# Altium schematic sheet Connectors.SchDoc
size A4; SheetNumber: 3; SheetTotal: 3
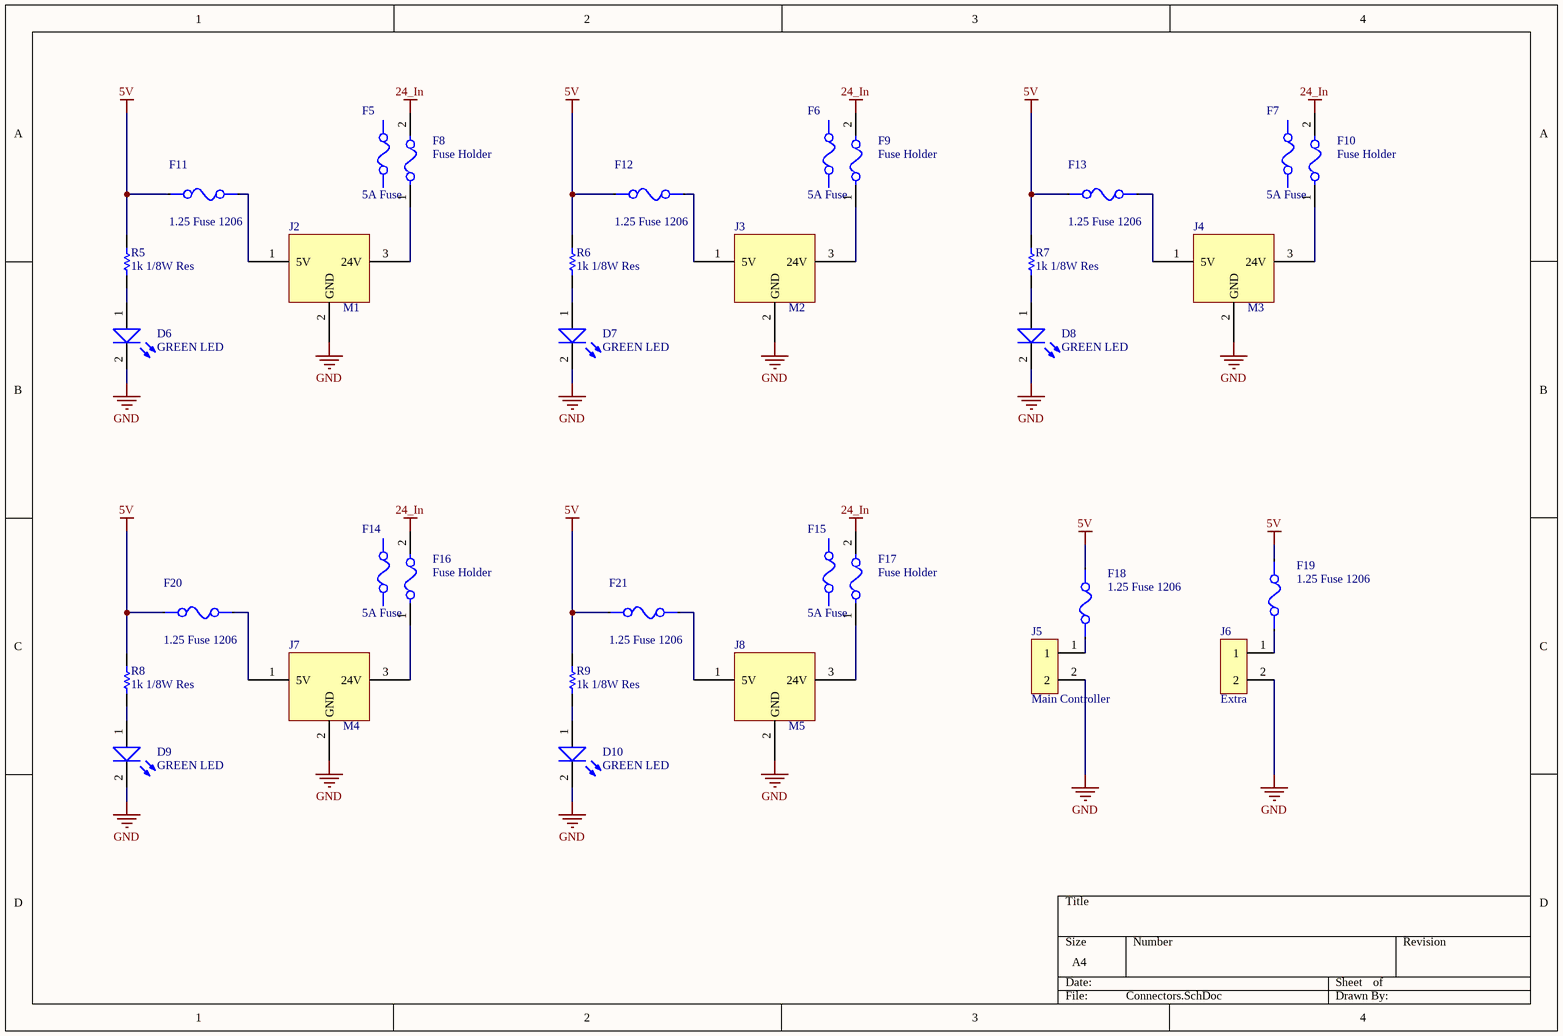
[diagram p0: Connectors.SchDoc]

## Parts
D6  GREEN LED  [LED Through Hole]
D7  GREEN LED  [LED Through Hole]
D8  GREEN LED  [LED Through Hole]
D9  GREEN LED  [LED Through Hole]
D10  GREEN LED  [LED Through Hole]
F5  5A Fuse  [5A Fuse]  (mechanical)
F6  5A Fuse  [5A Fuse]  (mechanical)
F7  5A Fuse  [5A Fuse]  (mechanical)
F8  Fuse Holder  [FUSE HOLDER]
F9  Fuse Holder  [FUSE HOLDER]
F10  Fuse Holder  [FUSE HOLDER]
F11  1.25 Fuse 1206  [Fuse 1206]
F12  1.25 Fuse 1206  [Fuse 1206]
F13  1.25 Fuse 1206  [Fuse 1206]
F14  5A Fuse  [5A Fuse]  (mechanical)
F15  5A Fuse  [5A Fuse]  (mechanical)
F16  Fuse Holder  [FUSE HOLDER]
F17  Fuse Holder  [FUSE HOLDER]
F18  1.25 Fuse 1206  [Fuse 1206]
F19  1.25 Fuse 1206  [Fuse 1206]
F20  1.25 Fuse 1206  [Fuse 1206]
F21  1.25 Fuse 1206  [Fuse 1206]
J2  M1  [MT-60]
J3  M2  [MT-60]
J4  M3  [MT-60]
J5  Main Controller  [XT60-M]
J6  Extra  [XT60-M]
J7  M4  [MT-60]
J8  M5  [MT-60]
R5  1k 1/8W Res  [0805 1K Resistor]
R6  1k 1/8W Res  [0805 1K Resistor]
R7  1k 1/8W Res  [0805 1K Resistor]
R8  1k 1/8W Res  [0805 1K Resistor]
R9  1k 1/8W Res  [0805 1K Resistor]

## Nets
5V: F11.1 F12.1 F13.1 F18.2 F19.2 F20.1 F21.1 R5.2 R6.2 R7.2 R8.2 R9.2
24_In: F8.2 F9.2 F10.2 F16.2 F17.2
GND: D6.2(K) D7.2(K) D8.2(K) D9.2(K) D10.2(K) J2.2(GND) J3.2(GND) J4.2(GND) J5.2 J6.2 J7.2(GND) J8.2(GND)
NetD6_1: D6.1(A) R5.1
NetD7_1: D7.1(A) R6.1
NetD8_1: D8.1(A) R7.1
NetD9_1: D9.1(A) R8.1
NetD10_1: D10.1(A) R9.1
NetF8_1: F8.1 J2.3(24V)
NetF9_1: F9.1 J3.3(24V)
NetF10_1: F10.1 J4.3(24V)
NetF11_2: F11.2 J2.1(5V)
NetF12_2: F12.2 J3.1(5V)
NetF13_2: F13.2 J4.1(5V)
NetF16_1: F16.1 J7.3(24V)
NetF17_1: F17.1 J8.3(24V)
NetF18_1: F18.1 J5.1
NetF19_1: F19.1 J6.1
NetF20_2: F20.2 J7.1(5V)
NetF21_2: F21.2 J8.1(5V)

## Library data of the parts
D6-D10 = HLMP-4740: Round with Domed Top HLMP-4740 SINGLE COLOR LED Green LED Indication Discrete 6.1mm 5V 2mA 2.3mcd; Manufacturer: Broadcom; Dominant Wavelength: 569nm; Forward Current: 7mA; Forward Voltage: 2.2V; Lead Length: 25mm; Lens Size: 5mm; Lens Style: Diffused; Luminous Intensity: 1mcd; Max Power Dissipation: 15.4mW; Number of Circuits: 1; Peak Wavelength: 565nm; Viewing Angle: 50°; Supplier: Avnet; Supplier Part Number: HLMP-4740; Manufacturer Part Number: HLMP-4740; RoHS: Compliant; Category: LEDs; Stock: 3902; Pricing: 2000=0.16434, 4000=0.16351, 8000=0.16268, 16000=0.16185, 32000=0.16102 (USD); Case/Package: Radial; China RoHS: Compliant; Color: Green; Contact Plating: Tin; Depth: 6.1mm; Diameter: 5.08mm; Export Control Classification Number (ECCN) Code: EAR99; Height: 8.81mm; Harmonized Tariff Schedule (HTS) Code: 8541.41.00.00; Illumination Color: Green; Introduction Date: 1992-01-01; Lead Free: Lead Free; Length: 6.1mm; Lens Color: Green; Lens Transparency: Diffused; Lifecycle Status: Production; Max Operating Temperature: 100°C; Min Operating Temperature: -20°C; Mounting Technology: PCB, Through Hole; Number of Elements: 1; Number of LEDs: 1; Pins: 2; Number of Terminals: 1; Packaging: Bulk; Power Dissipation: 15.4mW; Radiation Hardening: No; REACH SVHC: Yes; Reverse Voltage: 5V; Shape: Round; Terminal Pitch: 2.54mm; Test Current: 2mA; Wavelength: 569nm; ComponentLink1URL: https://datasheet.octopart.com:443/HLMP-4740-Broadcom-datasheet-179994660.pdf?src-supplier=IHS; ComponentLink1Description: https://datasheet.octopart.com:443/HLMP-4740-Broadcom-datasheet-179994660.pdf?src-supplier=IHS; ComponentLink2URL: https://datasheet.octopart.com:443/HLMP-4740-Broadcom-datasheet-10307821.pdf?src-supplier=Future+Electronics; ComponentLink2Description: https://datasheet.octopart.com:443/HLMP-4740-Broadcom-datasheet-10307821.pdf?src-supplier=Future+Electronics; ComponentLink3URL: https://datasheet.octopart.com:443/HLMP-4740-Avago-datasheet-8325423.pdf?src-supplier=Future+Electronics; ComponentLink3Description: https://datasheet.octopart.com:443/HLMP-4740-Avago-datasheet-8325423.pdf?src-supplier=Future+Electronics; ComponentLink4URL: https://datasheet.octopart.com:443/HLMP-4740-Broadcom-datasheet-41234193.pdf?src-supplier=Avago; ComponentLink4Description: https://datasheet.octopart.com:443/HLMP-4740-Broadcom-datasheet-41234193.pdf?src-supplier=Avago; ComponentLink5URL: https://datasheet.octopart.com:443/HLMP-4740-Broadcom-datasheet-26590252.pdf?src-supplier=Newark; ComponentLink5Description: https://datasheet.octopart.com:443/HLMP-4740-Broadcom-datasheet-26590252.pdf?src-supplier=Newark; ComponentLink6URL: https://datasheet.octopart.com:443/HLMP-4740-Avago-datasheet-3474.pdf?src-supplier=Newark; ComponentLink6Description: https://datasheet.octopart.com:443/HLMP-4740-Avago-datasheet-3474.pdf?src-supplier=Newark; ComponentLink7URL: https://datasheet.octopart.com:443/HLMP-4740-Avago-datasheet-15068216.pdf?src-supplier=element14+APAC; ComponentLink7Description: https://datasheet.octopart.com:443/HLMP-4740-Avago-datasheet-15068216.pdf?src-supplier=element14+APAC; ComponentLink8URL: https://datasheet.octopart.com:443/HLMP-4740-Avago-datasheet-9617573.pdf?src-supplier=RS+(Formerly+Allied+Electronics); ComponentLink8Description: https://datasheet.octopart.com:443/HLMP-4740-Avago-datasheet-9617573.pdf?src-supplier=RS+(Formerly+Allied+Electronics); ComponentLink9URL: https://datasheet.octopart.com:443/HLMP-4740-Avago-datasheet-87738.pdf?src-supplier=RS+(Formerly+Allied+Electronics); ComponentLink9Description: https://datasheet.octopart.com:443/HLMP-4740-Avago-datasheet-87738.pdf?src-supplier=RS+(Formerly+Allied+Electronics); LCSC Part No: C7466713
F5-F7 F14 F15 = 0297005.WXNV: Fuse Blade 5A 32V Socket 10.9 X 3.8 X 8.8mm Polyamide 66 Automotive UL; Manufacturer: Littelfuse; Body Material: Thermoplastic; Color: Tan, Beige; Value: 17.75mΩ; Time to Trip: 30ms; Supplier: Arrow Electronics; Supplier Part Number: 0297005.WXNV; Manufacturer Part Number: 0297005.WXNV; RoHS: Compliant; Category: Fuses; Stock: 153681; Pricing: 1=0.1604, 5=0.1552, 10=0.1324 (USD); Contact Plating: Silver; Current Rating: 5A; Depth: 3.8mm; Fuse Current: 5A; Height: 8.8mm; Lead Free: Lead Free; Length: 10.9mm; Lifecycle Status: Production; Max Operating Temperature: 125°C; Min Operating Temperature: -40°C; Mounting Technology: Holder, Socket; Pins: 2; Packaging: Bulk; Radiation Hardening: No; REACH SVHC: Yes; Voltage Rating: 32V; Voltage Rating (AC): 32V; Voltage Rating (DC): 32V; Working Voltage: 32V; ComponentLink1URL: https://datasheet.octopart.com:443/0297005.WXNV-Littelfuse-datasheet-169126209.pdf?src-supplier=IHS; ComponentLink1Description: https://datasheet.octopart.com:443/0297005.WXNV-Littelfuse-datasheet-169126209.pdf?src-supplier=IHS; ComponentLink2URL: https://datasheet.octopart.com:443/0297005.WXNV-Littelfuse-datasheet-66660011.pdf?src-supplier=Burklin+Elektronik; ComponentLink2Description: https://datasheet.octopart.com:443/0297005.WXNV-Littelfuse-datasheet-66660011.pdf?src-supplier=Burklin+Elektronik; ComponentLink3URL: https://datasheet.octopart.com:443/0297005.WXNV-Littelfuse-datasheet-8702453.pdf?src-supplier=Farnell; ComponentLink3Description: https://datasheet.octopart.com:443/0297005.WXNV-Littelfuse-datasheet-8702453.pdf?src-supplier=Farnell; ComponentLink4URL: https://datasheet.octopart.com:443/0297005.WXNV-Littelfuse-datasheet-179407513.pdf?src-supplier=Electro+Sonic; ComponentLink4Description: https://datasheet.octopart.com:443/0297005.WXNV-Littelfuse-datasheet-179407513.pdf?src-supplier=Electro+Sonic; ComponentLink5URL: https://datasheet.octopart.com:443/0297005.WXNV-Littelfuse-datasheet-135736.pdf?src-supplier=Agility; ComponentLink5Description: https://datasheet.octopart.com:443/0297005.WXNV-Littelfuse-datasheet-135736.pdf?src-supplier=Agility; ComponentLink6URL: https://datasheet.octopart.com:443/0297005.WXNV-Littelfuse-datasheet-530200.pdf?src-supplier=Newark; ComponentLink6Description: https://datasheet.octopart.com:443/0297005.WXNV-Littelfuse-datasheet-530200.pdf?src-supplier=Newark; ComponentLink7URL: https://datasheet.octopart.com:443/0297005.WXNV-Littelfuse-datasheet-28809134.pdf?src-supplier=Future+Electronics; ComponentLink7Description: https://datasheet.octopart.com:443/0297005.WXNV-Littelfuse-datasheet-28809134.pdf?src-supplier=Future+Electronics; ComponentLink8URL: https://datasheet.octopart.com:443/0297005.WXNV-Littelfuse-datasheet-184785010.pdf?src-supplier=Master+Electronics; ComponentLink8Description: https://datasheet.octopart.com:443/0297005.WXNV-Littelfuse-datasheet-184785010.pdf?src-supplier=Master+Electronics; ComponentLink9URL: https://datasheet.octopart.com:443/0297005.WXNV-Littelfuse-datasheet-43098904.pdf?src-supplier=RS+(Formerly+Allied+Electronics); ComponentLink9Description: https://datasheet.octopart.com:443/0297005.WXNV-Littelfuse-datasheet-43098904.pdf?src-supplier=RS+(Formerly+Allied+Electronics); ComponentLink10URL: https://datasheet.octopart.com:443/0297005.WXNV-Littelfuse-datasheet-33028620.pdf?src-supplier=RS+(Formerly+Allied+Electronics); ComponentLink10Description: https://datasheet.octopart.com:443/0297005.WXNV-Littelfuse-datasheet-33028620.pdf?src-supplier=RS+(Formerly+Allied+Electronics); ComponentLink11URL: https://datasheet.octopart.com:443/0297005.WXNV-Littelfuse-datasheet-49878456.pdf?src-supplier=TME; ComponentLink11Description: https://datasheet.octopart.com:443/0297005.WXNV-Littelfuse-datasheet-49878456.pdf?src-supplier=TME; ComponentLink12URL: https://datasheet.octopart.com:443/0297005.WXNV-Littelfuse-datasheet-817.pdf?src-supplier=DigiKey; ComponentLink12Description: https://datasheet.octopart.com:443/0297005.WXNV-Littelfuse-datasheet-817.pdf?src-supplier=DigiKey; LCSC Part No: C151093
F8-F10 F16 F17 = 3568: Holder; Fuse; Auto Blade; Mini; 500VAC; 30A; PC Pin Terminal; Nylon 4/6 Holder; Black; Manufacturer: Keystone; Approvals: UL; Current Rating: 20A; Illumination Type: Illuminated; Material: Brass, Nylon, Tin; Number of Circuits: 1; Voltage: 500V; Supplier: Future Electronics; Supplier Part Number: 3568; Manufacturer Part Number: 3568; RoHS: Compliant; Category: Fuse Holders; Stock: 77707; Pricing: 30=0.74, 100=0.72, 250=0.71, 1000=0.69, 2500=0.66 (USD); Body Material: Nylon; Color: Black; Contact Material: Brass; Contact Plating: Tin; Country of Origin: USA; Depth: 6.73mm; Flammability Rating: UL94 V-0; Fuse Current: 20A; Introduction Date: 2015-08-28; Lead Free: Lead Free; Length: 16mm; Lifecycle Status: Production; Max Operating Temperature: 145°C; Min Operating Temperature: -50°C; Mounting Technology: PCB, Vertical; Number of Poles: 1; Orientation: Vertical; REACH SVHC: Yes; Termination: PC Pin; Voltage Rating (AC): 500V; ComponentLink1URL: https://datasheet.octopart.com:443/3568-Keystone-datasheet-137335555.pdf?src-supplier=Upverter; ComponentLink1Description: https://datasheet.octopart.com:443/3568-Keystone-datasheet-137335555.pdf?src-supplier=Upverter; ComponentLink2URL: https://datasheet.octopart.com:443/3568-Keystone-datasheet-15715963.pdf?src-supplier=Future+Electronics; ComponentLink2Description: https://datasheet.octopart.com:443/3568-Keystone-datasheet-15715963.pdf?src-supplier=Future+Electronics; ComponentLink3URL: https://datasheet.octopart.com:443/3568-Keystone-datasheet-7589202.pdf?src-supplier=Future+Electronics; ComponentLink3Description: https://datasheet.octopart.com:443/3568-Keystone-datasheet-7589202.pdf?src-supplier=Future+Electronics; ComponentLink4URL: https://datasheet.octopart.com:443/3568-Keystone-datasheet-137916591.pdf?src-supplier=Future+Electronics; ComponentLink4Description: https://datasheet.octopart.com:443/3568-Keystone-datasheet-137916591.pdf?src-supplier=Future+Electronics; ComponentLink5URL: https://datasheet.octopart.com:443/3568-Keystone-datasheet-21202853.pdf?src-supplier=element14+APAC; ComponentLink5Description: https://datasheet.octopart.com:443/3568-Keystone-datasheet-21202853.pdf?src-supplier=element14+APAC; ComponentLink6URL: https://datasheet.octopart.com:443/3568-Keystone-datasheet-10928834.pdf?src-supplier=RS+(Formerly+Allied+Electronics); ComponentLink6Description: https://datasheet.octopart.com:443/3568-Keystone-datasheet-10928834.pdf?src-supplier=RS+(Formerly+Allied+Electronics); ComponentLink7URL: https://datasheet.octopart.com:443/3568-Keystone-datasheet-110727069.pdf?src-supplier=RS+(Formerly+Allied+Electronics); ComponentLink7Description: https://datasheet.octopart.com:443/3568-Keystone-datasheet-110727069.pdf?src-supplier=RS+(Formerly+Allied+Electronics); ComponentLink8URL: https://datasheet.octopart.com:443/3568-Keystone-datasheet-17577430.pdf?src-supplier=TME; ComponentLink8Description: https://datasheet.octopart.com:443/3568-Keystone-datasheet-17577430.pdf?src-supplier=TME; LCSC Part No: C5249699
F11-F13 F18-F21 = 04661.25NRHF: Fuse 63V Fa Halogen Free Slim 1206 1.25A/ T&r Rohs Compliant: Yes |Littelfuse 04661.25NRHF; Current Rating: 1.25A; Power Dissipation: 107.1mW; Ratings: CE, CSA, TUV; Value: 57mΩ; Time to Trip: 200ms; Supplier: DigiKey; Supplier Part Number: F11418CT-ND; Manufacturer: Littelfuse; Manufacturer Part Number: 04661.25NRHF; RoHS: Compliant; Category: Fuses; Stock: 8292; Pricing: 1=1.14, 5=0.946, 10=0.873, 50=0.7246, 100=0.6685, 250=0.60084, 500=0.55408, 1000=0.51077 (USD); China RoHS: Compliant; Export Control Classification Number (ECCN) Code: EAR99; Height: 584µm; Harmonized Tariff Schedule (HTS) Code: 8536.10.00.40; Introduction Date: 2008-01-16; Length: 3.175mm; Lifecycle Status: Production; Max Operating Temperature: 90°C; Min Operating Temperature: -55°C; Mounting Technology: Surface Mount; REACH SVHC: No; Voltage Rating (AC): 63V; Voltage Rating (DC): 63V; ComponentLink1URL: https://datasheet.octopart.com:443/04661.25NRHF-Littelfuse-datasheet-166915437.pdf?src-supplier=IHS; ComponentLink1Description: https://datasheet.octopart.com:443/04661.25NRHF-Littelfuse-datasheet-166915437.pdf?src-supplier=IHS; ComponentLink2URL: https://datasheet.octopart.com:443/04661.25NRHF-Littelfuse-datasheet-120226766.pdf?src-supplier=ODG+(Origin+Data+Global); ComponentLink2Description: https://datasheet.octopart.com:443/04661.25NRHF-Littelfuse-datasheet-120226766.pdf?src-supplier=ODG+(Origin+Data+Global); ComponentLink3URL: https://datasheet.octopart.com:443/04661.25NRHF-Littelfuse-datasheet-170674135.pdf?src-supplier=JRH+Electronics; ComponentLink3Description: https://datasheet.octopart.com:443/04661.25NRHF-Littelfuse-datasheet-170674135.pdf?src-supplier=JRH+Electronics; ComponentLink4URL: https://datasheet.octopart.com:443/04661.25NRHF-Littelfuse-datasheet-178296321.pdf?src-supplier=Burklin+Elektronik; ComponentLink4Description: https://datasheet.octopart.com:443/04661.25NRHF-Littelfuse-datasheet-178296321.pdf?src-supplier=Burklin+Elektronik; ComponentLink5URL: https://datasheet.octopart.com:443/04661.25NRHF-Littelfuse-datasheet-183575681.pdf?src-supplier=Sager+Electronics; ComponentLink5Description: https://datasheet.octopart.com:443/04661.25NRHF-Littelfuse-datasheet-183575681.pdf?src-supplier=Sager+Electronics; ComponentLink6URL: https://datasheet.octopart.com:443/04661.25NRHF-Littelfuse-datasheet-24896369.pdf?src-supplier=Fuses+Unlimited; ComponentLink6Description: https://datasheet.octopart.com:443/04661.25NRHF-Littelfuse-datasheet-24896369.pdf?src-supplier=Fuses+Unlimited; LCSC Part No: C187601
J2-J4 J7 J8 = MT-60: LCSC part #: C99176
J5 J6 = PRT-10474: Conn DC Power Adapter M/F 2 POS ST 2 Terminal 1 Port; Manufacturer: SparkFun; Number of Contacts: 2; Supplier: Arrow Electronics; Supplier Part Number: PRT-10474; Manufacturer Part Number: PRT-10474; RoHS: Compliant; Category: Headers and Wire Housings; Pricing: 1=3.279 (USD); Number of Rows: 1; ComponentLink1URL: https://datasheet.octopart.com:443/PRT-10474-SparkFun-datasheet-154936240.pdf?src-supplier=Upverter; ComponentLink1Description: https://datasheet.octopart.com:443/PRT-10474-SparkFun-datasheet-154936240.pdf?src-supplier=Upverter
R5-R9 = RC0805FR-071KL: Yageo RC0805FR-071KL SMD Resistor 0603 1k Ohm ±1% Thick Film; Manufacturer: Yageo Group; Max Power Dissipation: 125mW; Value: 1kΩ; Temperature Coefficient: 100ppm/°C; Voltage Rating: 150V; Supplier: Future Electronics; Supplier Part Number: RC0805FR-071KL; Manufacturer Part Number: RC0805FR-071KL; RoHS: Compliant; Category: Chip SMD Resistors; Stock: 3035000; Pricing: 10000=0.0017, 50000=0.0017, 150000=0.0016, 375000=0.0016, 1000000=0.0015 (USD); Case/Package: 0805; Case Code (Imperial): 0805; China RoHS: Non-Compliant; Composition: Thick Film; Contact Plating: Tin; Country of Origin: Mainland China, Taiwan; Depth: 1.25mm; Export Control Classification Number (ECCN) Code: EAR99; Features: Moisture Resistant; Height: 500µm; Harmonized Tariff Schedule (HTS) Code: 8533.21.00.30; Introduction Date: 2004-09-22; Lead Free: Lead Free; Length: 2mm; Lifecycle Status: Production; Max Operating Temperature: 155°C; Military Standard: Not; Min Operating Temperature: -55°C; Mounting Technology: Surface Mount; Pins: 2; Number of Terminals: 2; Number of Terminations: 2; Packaging: Tape & Reel; Power Rating: 125mW; Radiation Hardening: No; REACH SVHC: Yes; Schedule B: 8533210045, 8533210045|8533210045, 8533210045|8533210045|8533210045, 8533210045|8533210045|8533210045|8533210045; Termination: SMD/SMT; Tolerance: 1%; Voltage Rating (AC): 150V; Voltage Rating (DC): 150V; Width: 1.25mm; Working Voltage: 150V; ComponentLink1URL: https://datasheet.octopart.com:443/RC0805FR-071KL-Yageo-datasheet-175887523.pdf?src-supplier=IHS; ComponentLink1Description: https://datasheet.octopart.com:443/RC0805FR-071KL-Yageo-datasheet-175887523.pdf?src-supplier=IHS; ComponentLink2URL: https://datasheet.octopart.com:443/RC0805FR-071KL-Yageo-datasheet-103092701.pdf?src-supplier=Upverter; ComponentLink2Description: https://datasheet.octopart.com:443/RC0805FR-071KL-Yageo-datasheet-103092701.pdf?src-supplier=Upverter; ComponentLink3URL: https://datasheet.octopart.com:443/RC0805FR-071KL-Yageo-datasheet-8330313.pdf?src-supplier=element14+APAC; ComponentLink3Description: https://datasheet.octopart.com:443/RC0805FR-071KL-Yageo-datasheet-8330313.pdf?src-supplier=element14+APAC; ComponentLink4URL: https://datasheet.octopart.com:443/RC0805FR-071KL-Yageo-datasheet-62067350.pdf?src-supplier=element14+APAC; ComponentLink4Description: https://datasheet.octopart.com:443/RC0805FR-071KL-Yageo-datasheet-62067350.pdf?src-supplier=element14+APAC; ComponentLink5URL: https://datasheet.octopart.com:443/RC0805FR-071KL-Yageo-datasheet-12592811.pdf?src-supplier=element14+APAC; ComponentLink5Description: https://datasheet.octopart.com:443/RC0805FR-071KL-Yageo-datasheet-12592811.pdf?src-supplier=element14+APAC; ComponentLink6URL: https://datasheet.octopart.com:443/RC0805FR-071KL-Yageo-Group-datasheet-190305687.pdf?src-supplier=Newark; ComponentLink6Description: https://datasheet.octopart.com:443/RC0805FR-071KL-Yageo-Group-datasheet-190305687.pdf?src-supplier=Newark; ComponentLink7URL: https://datasheet.octopart.com:443/RC0805FR-071KL-Yageo-Group-datasheet-176638170.pdf?src-supplier=Future+Electronics; ComponentLink7Description: https://datasheet.octopart.com:443/RC0805FR-071KL-Yageo-Group-datasheet-176638170.pdf?src-supplier=Future+Electronics; ComponentLink8URL: https://datasheet.octopart.com:443/RC0805FR-071KL-Yageo-datasheet-164759695.pdf?src-supplier=Future+Electronics; ComponentLink8Description: https://datasheet.octopart.com:443/RC0805FR-071KL-Yageo-datasheet-164759695.pdf?src-supplier=Future+Electronics; ComponentLink9URL: https://datasheet.octopart.com:443/RC0805FR-071KL-Yageo-datasheet-8324252.pdf?src-supplier=Future+Electronics; ComponentLink9Description: https://datasheet.octopart.com:443/RC0805FR-071KL-Yageo-datasheet-8324252.pdf?src-supplier=Future+Electronics; ComponentLink10URL: https://datasheet.octopart.com:443/RC0805FR-071KL-Yageo-datasheet-79472498.pdf?src-supplier=Megastar; ComponentLink10Description: https://datasheet.octopart.com:443/RC0805FR-071KL-Yageo-datasheet-79472498.pdf?src-supplier=Megastar; ComponentLink11URL: https://datasheet.octopart.com/RC0805FR-071KL-Yageo-datasheet-73766026.pdf; ComponentLink11Description: https://datasheet.octopart.com/RC0805FR-071KL-Yageo-datasheet-73766026.pdf; ComponentLink12URL: https://datasheet.octopart.com:443/RC0805FR-071KL-Yageo-datasheet-13691069.pdf?src-supplier=Farnell; ComponentLink12Description: https://datasheet.octopart.com:443/RC0805FR-071KL-Yageo-datasheet-13691069.pdf?src-supplier=Farnell; ComponentLink13URL: https://datasheet.octopart.com:443/RC0805FR-071KL-Yageo-datasheet-118657.pdf?src-supplier=DigiKey; ComponentLink13Description: https://datasheet.octopart.com:443/RC0805FR-071KL-Yageo-datasheet-118657.pdf?src-supplier=DigiKey; ComponentLink14URL: https://datasheet.octopart.com:443/RC0805FR-071KL-Yageo-datasheet-502840.pdf?src-supplier=element14; ComponentLink14Description: https://datasheet.octopart.com:443/RC0805FR-071KL-Yageo-datasheet-502840.pdf?src-supplier=element14; ComponentLink15URL: http://sigma.octopart.com:80/conflict_mineral_statement/Yageo-company-3.pdf?src-supplier=Compliance+Statements; ComponentLink15Description: http://sigma.octopart.com:80/conflict_mineral_statement/Yageo-company-3.pdf?src-supplier=Compliance+Statements; ComponentLink16URL: http://sigma.octopart.com:80/rohs_statement/Yageo-company-2.pdf?src-supplier=Compliance+Statements; ComponentLink16Description: http://sigma.octopart.com:80/rohs_statement/Yageo-company-2.pdf?src-supplier=Compliance+Statements; LCSC Part No: C95781